# EAGLE design Access ID (EAGLE 8.3.0)
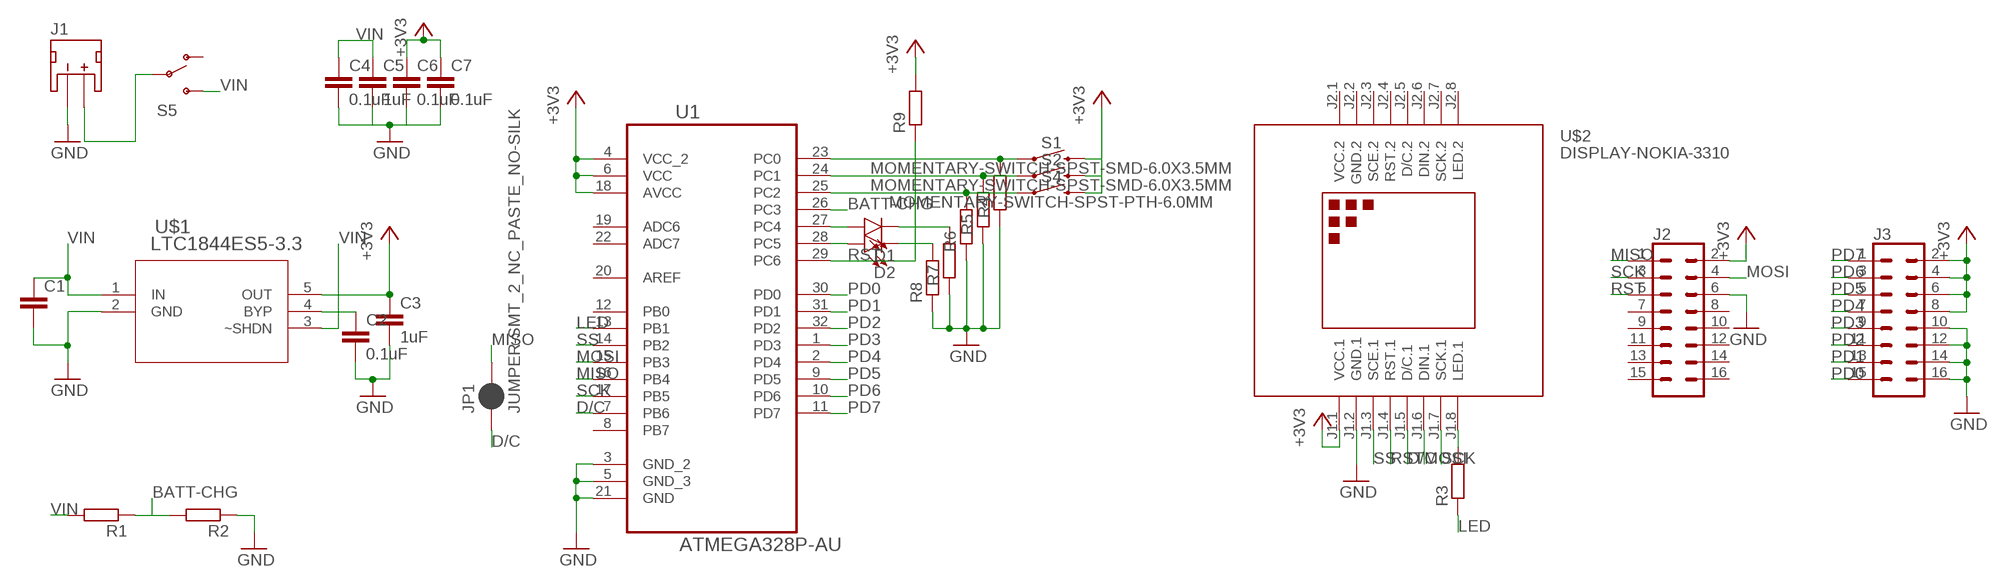
[diagram p0: schematic, sheet 1]

## Parts
C1  C-EUC0603K  [C0603K]
C2  0.1uF  C-EUC0603K  [C0603K]
C3  1uF  C-EUC0603K  [C0603K]
C4  0.1uF  C-EUC0603K  [C0603K]
C5  1uF  C-EUC0603K  [C0603K]
C6  0.1uF  C-EUC0603K  [C0603K]
C7  0.1uF  C-EUC0603K  [C0603K]
D1  LED0603  [LED-0603]
D2  LED0603  [LED-0603]
J1  JST_2MM_MALE  [JST-2-SMD]
J2  CONN_08X2  [2X8]
J3  CONN_08X2  [2X8]
JP1  JUMPER-SMT_2_NC_PASTE_NO-SILK  [SMT-JUMPER_2_NC_PASTE_NO-SILK]
R1  R-EU_R0603  [R0603]
R2  R-EU_R0603  [R0603]
R3  R-EU_R0603  [R0603]
R4  R-EU_R0603  [R0603]
R5  R-EU_R0603  [R0603]
R6  R-EU_R0603  [R0603]
R7  R-EU_R0603  [R0603]
R8  R-EU_R0603  [R0603]
R9  R-EU_R0603  [R0603]
S1  MOMENTARY-SWITCH-SPST-SMD-6.0X3.5MM  [TACTILE_SWITCH_SMD_6.0X3.5MM]
S2  MOMENTARY-SWITCH-SPST-SMD-6.0X3.5MM  [TACTILE_SWITCH_SMD_6.0X3.5MM]
S4  MOMENTARY-SWITCH-SPST-PTH-6.0MM  [TACTILE_SWITCH_PTH_6.0MM]
S5  SWITCH-SPDT-SMD-A  [SWITCH-SPST-SMD-A]
U1  ATMEGA328P-AU  [QFP80P900X900X120-32N]
U$1  LTC1844ES5-3.3  [TSOT-23_S5]
U$2  DISPLAY-NOKIA-3310  [DISPLAY-NOKIA-3310]

## Nets
+3V3: C3.1 C6.1 C7.1 J2.2 J3.2 J3.4 J3.6 J3.8 R9.2 S1.2 S2.2 S4.3 U1.4(VCC_2) U1.6(VCC) U1.18(AVCC) U$1.5(OUT) U$2.J1.1(VCC.1)
BATT-CHG: R1.1 R2.2 U1.26(PC3)
D/C: JP1.1 U1.7(PB6) U$2.J1.5(D/C.1)
GND: C1.2 C2.2 C3.2 C4.2 C5.2 C6.2 C7.2 J1.1(-) J2.6 J3.10 J3.12 J3.14 J3.16 R2.1 R4.1 R5.1 R6.1 R7.1 R8.1 U1.3(GND_2) U1.5(GND_3) U1.21(GND) U$1.2(GND) U$2.J1.2(GND.1)
LED: R3.1 U1.13(PB1)
MISO: J2.1 JP1.2 U1.16(PB4)
MOSI: J2.4 U1.15(PB3) U$2.J1.6(DIN.1)
N$2: C2.1 U$1.4(BYP)
N$5: R3.2 U$2.J1.8(LED.1)
N$7: J1.2(+) S5.2(P)
N$8: R5.2 S2.1 U1.24(PC1)
N$12: R6.2 S4.1 U1.25(PC2)
N$17: D2.C R8.2
N$18: R4.2 S1.1 U1.23(PC0)
N$19: D2.A U1.28(PC5)
N$20: D1.A U1.27(PC4)
N$21: D1.C R7.2
PD0: J3.15 U1.30(PD0)
PD1: J3.13 U1.31(PD1)
PD2: J3.11 U1.32(PD2)
PD3: J3.9 U1.1(PD3)
PD4: J3.7 U1.2(PD4)
PD5: J3.5 U1.9(PD5)
PD6: J3.3 U1.10(PD6)
PD7: J3.1 U1.11(PD7)
RST: J2.5 R9.1 U1.29(PC6) U$2.J1.4(RST.1)
SCK: J2.3 U1.17(PB5) U$2.J1.7(SCK.1)
SS: U1.14(PB2) U$2.J1.3(SCE.1)
VIN: C1.1 C4.1 C5.1 R1.2 S5.3(S) U$1.1(IN) U$1.3(~SHDN)
Unconnected: J1.NC1(PAD1) J1.NC2(PAD2) J2.7 J2.8 J2.9 J2.10 J2.11 J2.12 J2.13 J2.14 J2.15 J2.16 S5.1(O) U1.8(PB7) U1.12(PB0) U1.19(ADC6) U1.20(AREF) U1.22(ADC7) U$2.J2.3(SCE.2) U$2.J2.4(RST.2) U$2.J2.5(D/C.2) U$2.J2.6(DIN.2) U$2.J2.7(SCK.2) U$2.J2.8(LED.2)

## Power pins joined to a net without a drawn wire
GND.2: U$2.J2.2(GND.2)
VCC.2: U$2.J2.1(VCC.2)

## Library data of the parts
C1-C7 = resistor:C-EU: CAPACITOR, European symbol
D1 D2 = SparkFun-LED:LED: LED (Generic) Standard schematic elements and footprints for 5mm, 3mm, 1206, and 0603 sized LEDs. Generic LEDs with no color specified.
J1 = SparkFun-Connectors:JST_2MM_MALE: Mates to single-cell LiPo batteries. CONN-11443 Now with smashable polarity marks!; BTM_NEG: -; BTM_POS: +; PROD_ID: CONN-11443; TOP_NEG: -; TOP_POS: +
J2 J3 = SparkFun-Connectors:CONN_08X2: Multi connection point. Often used as Generic Header-pin footprint for 0.1 inch spaced/style header connections You can populate with any combo of single row headers, but if you'd like an exact match, check this: Header - 2x8 (Male, 0.1") <https://www.sparkfun.com/products/13156> (PRT-13156) On any of the 0.1 inch spaced packages, you can populate with these: Break Away Headers - Straight <https://www.sparkfun.com/products/116> (PRT-00116) Break Away Male Headers - Right Angle <https://www.sparkfun.com/products/553> (PRT-00553) Female Headers <https://www.sparkfun.com/products/115> (PRT-00115) Break Away Headers - Machine Pin <https://www.sparkfun.com/products/117> (PRT-00117) Break Away Female Headers - Swiss Machine Pin <https://www.sparkfun.com/products/743> (PRT-00743)
JP1 = SparkFun-Jumpers:JUMPER-SMT_2_NC_PASTE: Normally closed solder jumper This jumper has an aperture in the stencil to allow solder paste to bridge the split in the wire so it's normally closed (NC). Wick off the solder to open the connection. Reapply solder to reclose the connection.
R1-R9 = resistor:R-EU_: RESISTOR, European symbol
S1 S2 = SparkFun-Switches:MOMENTARY-SWITCH-SPST: Momentary Switch (Pushbutton) - SPST Normally-open (NO) SPST momentary switches (buttons, pushbuttons). Variants PTH-12MM - 12mm square, through-hole Momentary Pushbutton Switch - 12mm Square <https://www.sparkfun.com/products/9190> (COM-09190) PTH-6.0MM, PTH-6.0MM-KIT - 6.0mm square, through-hole Mini Pushbutton Switch <https://www.sparkfun.com/products/97> (COM-00097) KIT package intended for soldering kit's - only one side of pads' copper is exposed. PTH-RIGHT-ANGLE-KIT - Right-angle, through-hole Right Angle Tactile Button <https://www.sparkfun.com/products/10791> - Used on SparkFun BigTime Watch Kit <https://www.sparkfun.com/products/11734> SMD-12MM - 12mm square, surface-mount Tactile Button - SMD (12mm) <https://www.sparkfun.com/products/12993> (COM-12993) Used on SparkFun PicoBoard <https://www.sparkfun.com/products/11888> SMD-4.5MM - 4.5mm Square Trackball Switch Used on SparkFun Blackberry Trackballer Breakout <https://www.sparkfun.com/products/13169> SMD-4.6MMX2.8MM - 4.60mm x 2.80mm, surface mount Used on SparkFun SAMD21 Mini Breakout <https://www.sparkfun.com/products/13664> SMD-5.2MM, SMD-5.2-REDUNDANT - 5.2mm square, surface-mount Mini Pushbutton Switch - SMD <https://www.sparkfun.com/products/8720> (COM-08720) Used on Arduino Pro Mini <https://www.sparkfun.com/products/11114> REDUNDANT package connects both switch circuits together SMD-6.0X3.5MM - 6.0 x 3.5mm, surface mount Momentary Reset Switch SMD <https://www.sparkfun.com/products/8229> (COM-08229) SMD-6.2MM-TALL - 6.2mm square, surface mount Tactile Button - SMD (6mm) <https://www.sparkfun.com/products/12992> Used on SparkFun Digital Sandbox <https://www.sparkfun.com/products/12651> SMD-RIGHT-ANGLE - Right-angle, surface mount Used on SparkFun Block for Intel® Edison - Arduino <https://www.sparkfun.com/products/13036>; PROD_ID: SWCH-00815; SF_SKU: COM-08229
S4 = SparkFun-Switches:MOMENTARY-SWITCH-SPST: Momentary Switch (Pushbutton) - SPST Normally-open (NO) SPST momentary switches (buttons, pushbuttons). Variants PTH-12MM - 12mm square, through-hole Momentary Pushbutton Switch - 12mm Square <https://www.sparkfun.com/products/9190> (COM-09190) PTH-6.0MM, PTH-6.0MM-KIT - 6.0mm square, through-hole Mini Pushbutton Switch <https://www.sparkfun.com/products/97> (COM-00097) KIT package intended for soldering kit's - only one side of pads' copper is exposed. PTH-RIGHT-ANGLE-KIT - Right-angle, through-hole Right Angle Tactile Button <https://www.sparkfun.com/products/10791> - Used on SparkFun BigTime Watch Kit <https://www.sparkfun.com/products/11734> SMD-12MM - 12mm square, surface-mount Tactile Button - SMD (12mm) <https://www.sparkfun.com/products/12993> (COM-12993) Used on SparkFun PicoBoard <https://www.sparkfun.com/products/11888> SMD-4.5MM - 4.5mm Square Trackball Switch Used on SparkFun Blackberry Trackballer Breakout <https://www.sparkfun.com/products/13169> SMD-4.6MMX2.8MM - 4.60mm x 2.80mm, surface mount Used on SparkFun SAMD21 Mini Breakout <https://www.sparkfun.com/products/13664> SMD-5.2MM, SMD-5.2-REDUNDANT - 5.2mm square, surface-mount Mini Pushbutton Switch - SMD <https://www.sparkfun.com/products/8720> (COM-08720) Used on Arduino Pro Mini <https://www.sparkfun.com/products/11114> REDUNDANT package connects both switch circuits together SMD-6.0X3.5MM - 6.0 x 3.5mm, surface mount Momentary Reset Switch SMD <https://www.sparkfun.com/products/8229> (COM-08229) SMD-6.2MM-TALL - 6.2mm square, surface mount Tactile Button - SMD (6mm) <https://www.sparkfun.com/products/12992> Used on SparkFun Digital Sandbox <https://www.sparkfun.com/products/12651> SMD-RIGHT-ANGLE - Right-angle, surface mount Used on SparkFun Block for Intel® Edison - Arduino <https://www.sparkfun.com/products/13036>; PROD_ID: SWCH-08441; SF_SKU: COM-00097
S5 = SparkFun-Electromechanical:SWITCH-SPDT: SPDT Switch Simple slide switch, Spark Fun Electronics SKU : COM-00102 DPDT SMT slide switch, AYZ0202, SWCH-08179; PROD_ID: SWCH-10651
U1 = Atmel_By_element14_Batch_1-00:ATMEGA328P-AU: 8-bit Microcontroller with In-System Programmable Flash; MPN: ATMEGA328P-AU; OC_FARNELL: 1715486; OC_NEWARK: 14R4631; PACKAGE: TQFP-32; SUPPLIER: Atmel
U$1 = Beeclust:LTC1844ES5-3.3
U$2 = diy-modules:DISPLAY-NOKIA-3310: 84x48 Dot Matrix LCD Module based on Nokia 3310 display More details available here: https://arduinoandsoftware.wordpress.com/2012/12/30/nokia-33105110-3-3v-display-with-5v-arduino/

## Board
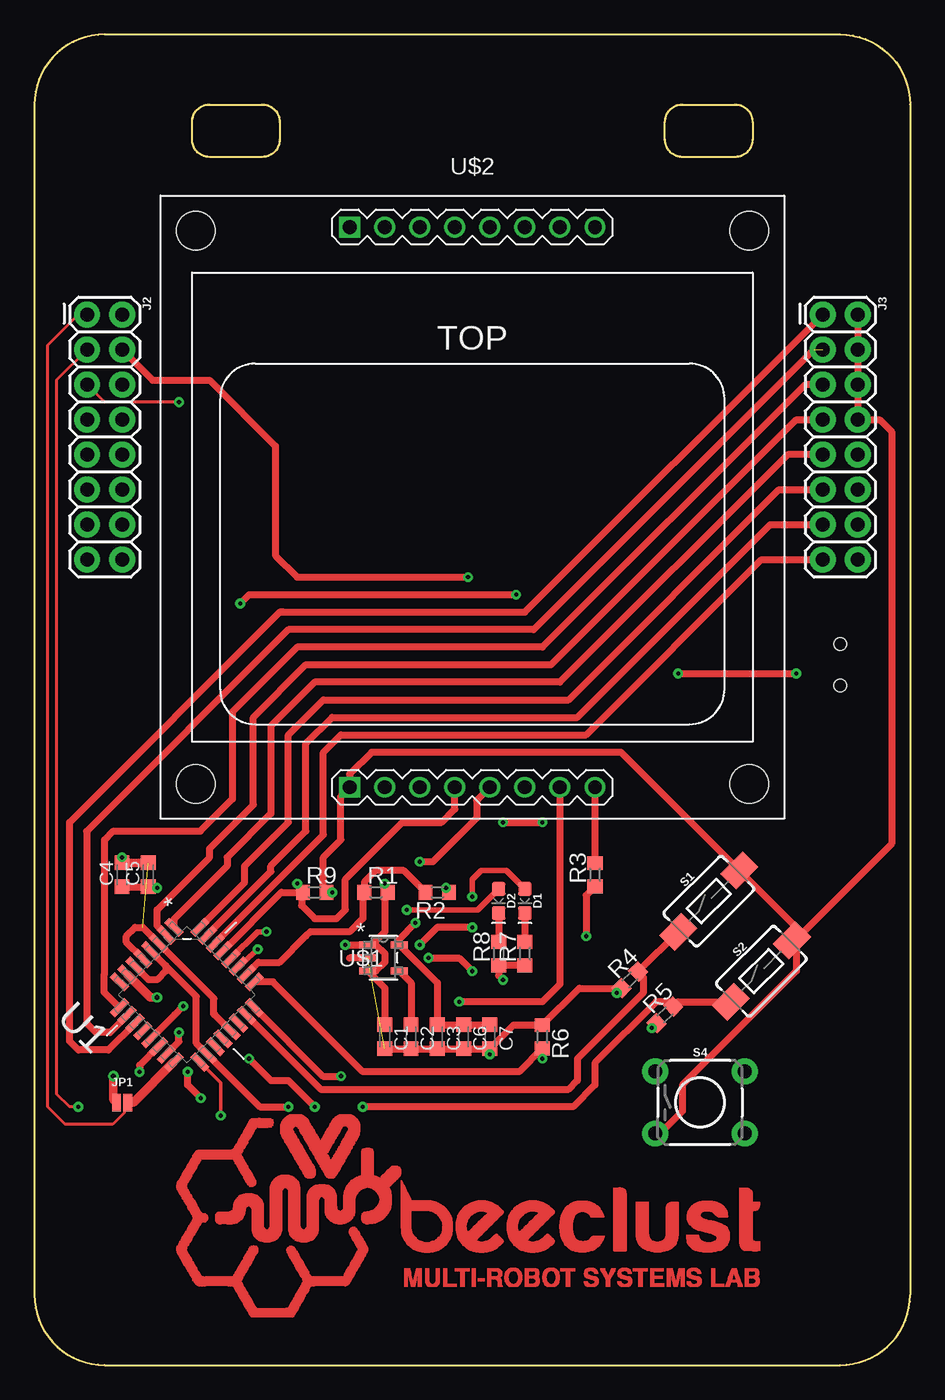
[diagram p1: board, top side]
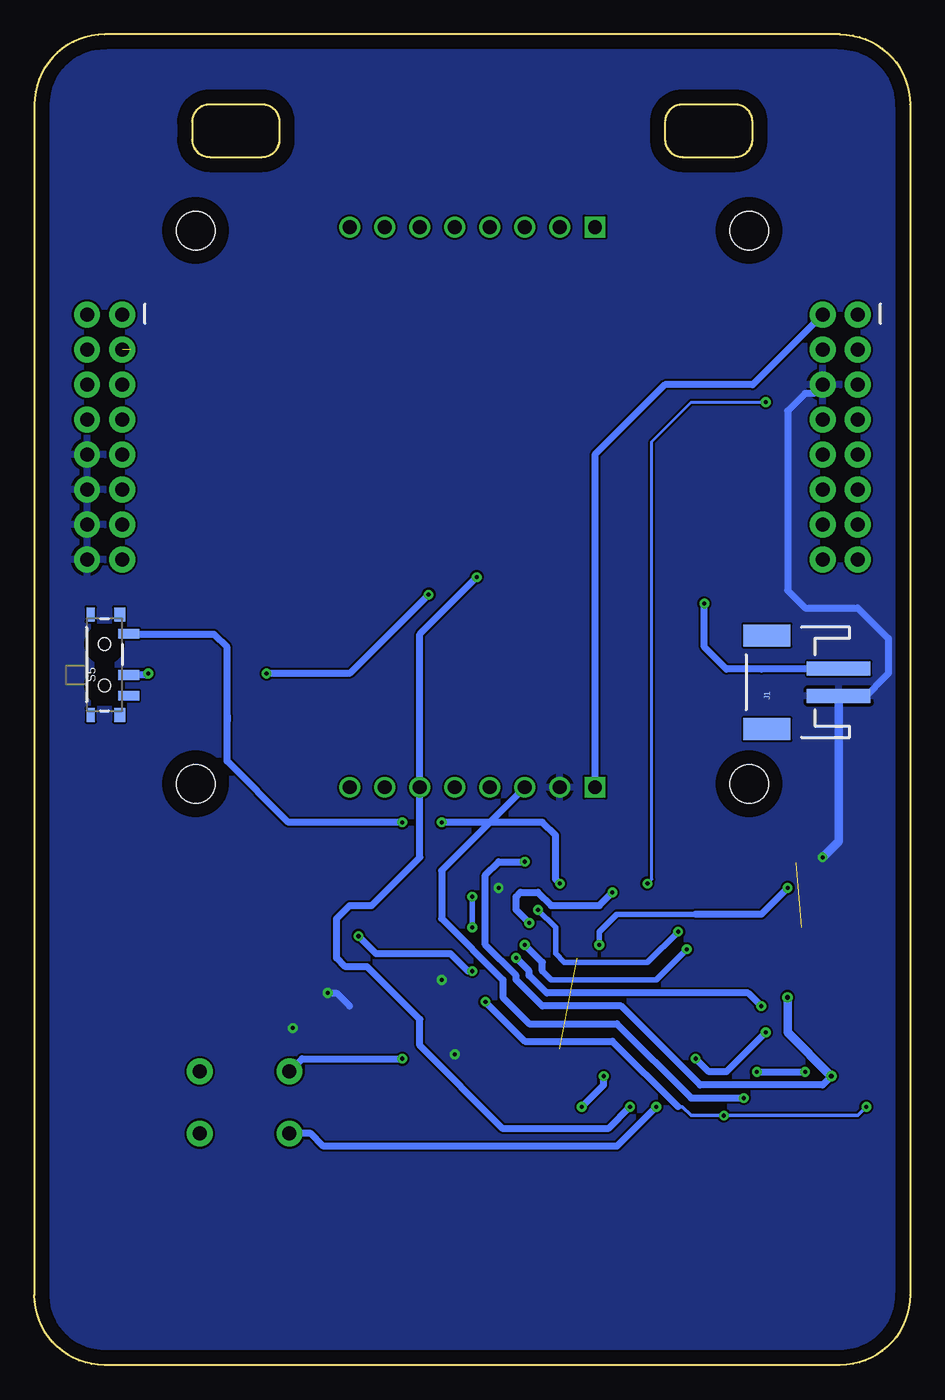
[diagram p2: board, bottom side, seen from below]

Size 63.5 x 96.52 mm. Coordinates in mm from the lower left corner, seen from the top.
Outline: 5.08,96.52 58.42,96.52 arc-90 63.5,91.44 63.5,5.08 arc-90 58.42,0 5.08,0 arc-90 0,5.08 0,91.44 arc-90 5.08,96.52
Outline: 11.43,90.17 arc-90 12.7,91.44 16.51,91.44 arc-90 17.78,90.17 17.78,88.9 arc-90 16.51,87.63 12.7,87.63 arc-90 11.43,88.9 11.43,90.17
Outline: 45.72,90.17 arc-90 46.99,91.44 50.8,91.44 arc-90 52.07,90.17 52.07,88.9 arc-90 50.8,87.63 46.99,87.63 arc-90 45.72,88.9 45.72,90.17
Copper layers (1*16): Top 0.035mm / dielectric 1.5mm / Bottom 0.035mm
Design rules "default": minimum track width 6mil, minimum drill 0.35mm, track to track 6mil, track to pad 6mil, pad to pad 6mil, via to via 6mil, smd to smd 6mil, copper to edge 40mil, drill to drill 6mil, minimum pad ring 10mil, minimum via ring 8mil, stop-mask expansion 4mil, vias tented up to drill 0mil, thermal gap 10mil

### Footprints (pad centres in the part's own frame; a part is rotated, then mirrored left to right if it is on the bottom)
C0603K = smd 1.05 x 1.08: 1 -0.875,0; 2 0.875,0
LED-0603 = smd 1 x 1: A -0.877,0; C 0.877,0
JST-2-SMD = smd 1 x 4.6: 1 -1,-3.7; 2 1,-3.7 | smd 1.6 x 3.4: NC1 -3.4,1.5; NC2 3.4,1.5
2X8 = drill 1.016 pad 1.88: 1 0,0; 2 0,2.54; 3 2.54,0; 4 2.54,2.54; 5 5.08,0; 6 5.08,2.54; 7 7.62,0; 8 7.62,2.54; 9 10.16,0; 10 10.16,2.54; 11 12.7,0; 12 12.7,2.54; 13 15.24,0; 14 15.24,2.54; 15 17.78,0; 16 17.78,2.54
SMT-JUMPER_2_NC_PASTE_NO-SILK = smd 0.635 x 1.27: 1 -0.406,0; 2 0.406,0
R0603 = smd 1 x 1.1: 1 -0.85,0; 2 0.85,0
TACTILE_SWITCH_SMD_6.0X3.5MM = smd 2.3 x 1.6: 1 -3.15,0; 2 3.15,0
TACTILE_SWITCH_PTH_6.0MM = drill 1.016 pad 1.88: 1 -3.251,2.261; 2 3.251,2.261; 3 -3.251,-2.261; 4 3.251,-2.261
SWITCH-SPST-SMD-A = smd 0.7 x 1.5: 1 -2.25,-1.75; 2 -0.75,-1.75; 3 2.25,-1.75 | smd 1 x 0.6: GND1 -3.65,1; GND3 3.65,1 | smd 1 x 0.8: GND2 -3.65,-1.1; GND4 3.65,-1.1 | hole 0.9: -1.5,0; 1.5,0
QFP80P900X900X120-32N = smd 1.473 x 0.508: 1 -4.115,2.794; 2 -4.115,2.007; 3 -4.115,1.194; 4 -4.115,0.406; 5 -4.115,-0.406; 6 -4.115,-1.194; 7 -4.115,-2.007; 8 -4.115,-2.794; 17 4.115,-2.794; 18 4.115,-2.007; 19 4.115,-1.194; 20 4.115,-0.406; 21 4.115,0.406; 22 4.115,1.194; 23 4.115,2.007; 24 4.115,2.794 | smd 0.508 x 1.473: 9 -2.794,-4.115; 10 -2.007,-4.115; 11 -1.194,-4.115; 12 -0.406,-4.115; 13 0.406,-4.115; 14 1.194,-4.115; 15 2.007,-4.115; 16 2.794,-4.115; 25 2.794,4.115; 26 2.007,4.115; 27 1.194,4.115; 28 0.406,4.115; 29 -0.406,4.115; 30 -1.194,4.115; 31 -2.007,4.115; 32 -2.794,4.115
TSOT-23_S5 = smd 1.219 x 0.508: 1 -1.143,0.95; 2 -1.143,0; 3 -1.143,-0.95; 4 1.143,-0.95; 5 1.143,0.95
DISPLAY-NOKIA-3310 = drill 1 square: J1.1 -8.89,-20.32; J2.1 -8.89,20.32 | drill 1: J1.2 -6.35,-20.32; J1.3 -3.81,-20.32; J1.4 -1.27,-20.32; J1.5 1.27,-20.32; J1.6 3.81,-20.32; J1.7 6.35,-20.32; J1.8 8.89,-20.32; J2.2 -6.35,20.32; J2.3 -3.81,20.32; J2.4 -1.27,20.32; J2.5 1.27,20.32; J2.6 3.81,20.32; J2.7 6.35,20.32; J2.8 8.89,20.32 | hole 2.8: -20.066,-20.066; 20.066,-20.066; 20.066,20.066; -20.066,20.066

### Placement (x,y rotation side)
C1  25.4,23.81 270 top
C2  27.3,23.81 270 top
C3  29.21,23.81 270 top
C4  6.35,35.56 90 top
C5  8.26,35.56 90 top
C6  31.11,23.81 270 top
C7  33.02,23.81 270 top
D1  35.56,33.66 270 top
D2  33.66,33.66 270 top
J1  8.89,49.53 90 bottom
J2  3.81,76.2 270 top
J3  57.15,76.2 270 top
JP1  6.35,19.05 0 top
R1  24.77,34.29 0 top
R2  29.21,34.29 180 top
R3  40.64,35.56 90 top
R4  43.18,27.94 45 top
R5  45.72,25.4 45 top
R6  36.83,23.81 270 top
R7  35.56,29.84 90 top
R8  33.66,29.84 90 top
R9  20.32,34.29 0 top
S1  48.9,33.66 45 top
S2  52.7,28.57 45 top
S4  48.26,19.05 0 top
S5  58.42,50.8 90 bottom
U1  11.05,26.86 315 top
U$1  25.3,29.54 0 top
U$2  31.75,62.23 0 top

### Tracks (layer width: path | path; a pad name or v marks a point on that pad's centre or on a via)
+3V3  (via drill 0.3)
  Top 0.508: U1.6 8.28,27.94 8.89,27.94 9.53,28.57 9.53,28.96 | U1.4 9.53,28.96 | 54.93,30.58 54.93,30.48 55.24,30.16 55.24,31.76 S1.2 42.55,44.45 24.45,44.45 22.86,42.86 U$2.J1.1 22.23,41.27 22.23,38.1 20.95,36.83 20.95,34.51 R9.2 v21.59,34.29 | 54.93,30.58 S2.2 55.24,30.49 55.24,28.57 46.99,20.32 46.99,18.41 45.36,16.79 S4.3 | C7.1 C6.1 C3.1 29.21,27.72 U$1.5 26.44,30.89 v27.62,32.07 | J3.2 J3.4 J3.6 J3.8 61.28,68.58 62.15,67.7 62.15,37.8 54.93,30.58 | 9.53,28.96 11.75,26.74 11.75,23.32 U1.18 16.34,18.73 v18.41,18.73
  Bottom 0.508: J2.2 11.43,71.12 17.78,71.12 22.86,66.04 U$2.J1.1 | v27.62,32.07 28.57,33.02 28.57,33.97 28.26,34.29 26.99,34.29 26.04,33.34 22.54,33.34 v21.59,34.29 | v18.41,18.73 21.27,15.88 42.55,15.88 43.46,16.79 S4.3
BATT-CHG
  Top 0.508: R2.2 26.77,35.88 24.77,35.88 23.91,35.03 R1.1 23.81,34.19 23.81,32.38 22.86,31.43 20,31.43 19.68,31.12 17.78,29.21 16.24,29.21 U1.26
D/C  (via drill 0.3, 0.35)
  Top 0.508: U$2.J1.5 32.07,40.96 32.07,39.69 28.89,36.51 v27.94,36.51
  Top 0.61: U1.7 8.4,26.67 v8.89,26.67 | JP1.1 5.71,19.28 v5.71,20.96
  Bottom 0.508: v5.71,20.96 6.35,20.32 15.24,20.32 20.95,26.04 26.67,26.04 28.57,27.94 28.57,28.26 30.8,30.48 30.8,35.56 29.84,36.51 v27.94,36.51
  Bottom 0.61: v8.89,26.67 8.89,24.13 v5.71,20.96
GND  (via drill 0.3)  (2 unrouted)
  Top 0.508: U$1.2 24.14,29.53 22.86,29.53 | C1.2 C2.2 C3.2 C6.2 C7.2 | C7.2 34.74,24.66 R6.1 39.51,27.34 R4.1 v42.23,26.99 | R7.1 R8.1 33.66,28.26 v33.97,27.94 | U1.21 13.08,25.4 13.02,25.4 13.02,26.58 U1.3 7.85,31.75 7.3,31.75 6.67,31.12 6.67,30.67 U1.5 | R5.1 v44.77,24.45 | R2.1 30.06,34.39 v29.84,34.61 | C7.2 v33.02,22.54
  Top 0.61: v6.35,36.83 C4.2 C5.2
  Bottom 0.508: J2.6 6.99,70.48 7.62,70.48 8.89,69.21 8.89,56.2 7.62,54.93 3.81,54.93 1.59,52.7 1.59,50.16 3.49,48.26 4.13,48.26 4.24,48.38 5.19,48.38 | v42.23,26.99 41.59,26.99 40.64,26.04
  Bottom 0.61: v6.35,36.83 5.19,37.99 5.19,48.38 J1.1
  pour Bottom: 0,88.58 0,91.44 arc-90 5.08,96.52 58.42,96.52 arc-90 63.5,91.44 63.5,5.4 arc-90 58.1,0 4.76,0 arc-90 0,4.76
LED  (via drill 0.3)
  Top 0.508: U1.13 10.16,25.4 v10.79,26.04 | R3.1 40.01,34.08 v40.01,31.12 | v28.57,29.53 30.8,29.53 v31.75,28.57
  Bottom 0.508: v10.79,26.04 11.75,26.99 26.35,26.99 27.62,28.26 27.62,28.57 v28.57,29.53 | v40.01,31.12 38.73,29.84 33.34,29.84 32.07,28.57 v31.75,28.57
MISO
  Top 0.203: JP1.2 6.51,18.81 6.51,18.31 5.67,17.46 2.22,17.46 0.95,18.73 0.95,73.98 3.17,76.2 J2.1
  Top 0.61: U1.16 7.19,19.05 JP1.2
MOSI  (via drill 0.3)
  Top 0.508: J2.4 8.57,71.44 12.7,71.44 17.46,66.67 17.46,58.74 19.05,57.15 v31.43,57.15 | U1.15 10.48,23.45 v10.48,24.13 | v15.56,22.23 17.14,20.64 18.41,20.64 v20.32,18.73
  Bottom 0.508: v31.43,57.15 35.56,53.02 U$2.J1.6 35.56,36.83 39.05,33.34 40.64,33.34 41.59,32.38 41.59,29.53 40.96,28.89 39.37,28.89 35.56,25.08 35.56,23.18 29.53,17.14 21.91,17.14 v20.32,18.73 | v15.56,22.23 14.61,21.27 13.34,21.27 v10.48,24.13
N$2
  Top 0.508: U$1.4 27.3,27.73 C2.1
N$5
  Top 0.508: U$2.J1.8 R3.2
N$7  (via drill 0.3)
  Top 0.508: v14.92,55.24 15.56,55.88 v34.92,55.88 | v46.67,50.16 v55.24,50.16
  Bottom 0.508: J1.2 5.24,50.48 10.79,50.48 13.34,50.48 14.92,52.07 v14.92,55.24 | v34.92,55.88 40.64,50.16 v46.67,50.16 | v55.24,50.16 55.36,50.05 S5.2
N$8  (via drill 0.3)
  Top 0.508: U1.24 20.91,20.96 v22.23,20.96 | v23.81,18.73 39.05,18.73 40.64,20.32 40.64,21.91 45.09,26.35 45.97,26.35 R5.2 46.67,26.35 S2.1
  Bottom 0.508: v23.81,18.73 22.23,20.32 v22.23,20.96
N$12  (via drill 0.3)
  Top 0.508: U1.25 17.29,27.79 23.81,21.27 35.14,21.27 R6.2 v36.83,22.23
  Bottom 0.508: 44.97,21.27 S4.1 44.09,22.23 v36.83,22.23
N$17
  Top 0.508: D2.C R8.2
N$18
  Top 0.508: S1.1 R4.2 44.13,28.19 44.13,26.99 39.37,22.23 39.37,20.64 38.73,20 20.75,20 U1.23
N$19  (via drill 0.3)
  Top 0.406: D2.A 32.14,33.02 v26.99,33.02 | U1.28 16.2,31.43 v16.83,31.43
  Bottom 0.406: v26.99,33.02 25.72,31.75 25.72,29.84 25.08,29.21 19.05,29.21 v16.83,31.43
N$20  (via drill 0.3)
  Top 0.406: D1.A 34.22,35.88 32.38,35.88 31.75,35.24 v31.75,33.97 | U1.27 v16.19,30.16
  Top 0.508: v31.75,31.75 29.21,31.75 v27.94,30.48
  Bottom 0.406: 26.67,28.57 26.04,27.94 18.41,27.94 v16.19,30.16 | v31.75,31.75 v31.75,33.97
  Bottom 0.508: 26.67,28.57 26.67,29.21 v27.94,30.48
N$21
  Top 0.508: D1.C R7.2
PD0
  Top 0.508: U1.30 20.95,38.45 20.95,44.45 22.23,45.72 40.01,45.72 52.7,58.42 J3.15
PD1
  Top 0.508: U1.31 17.14,35.79 17.14,36.2 19.68,38.73 19.68,45.09 21.59,46.99 39.37,46.99 53.34,60.96 J3.13
PD2
  Top 0.508: U1.32 15.24,35 15.24,36.2 18.41,39.37 18.41,45.72 20.95,48.26 38.73,48.26 53.98,63.5 J3.11
PD3
  Top 0.508: J3.9 54.61,66.04 38.1,49.53 20.32,49.53 17.14,46.36 17.14,40.01 13.97,36.83 13.97,36.2 10.12,32.34 U1.1
PD4
  Top 0.508: U1.2 8.89,31.86 8.89,33.02 12.7,36.83 12.7,37.47 15.88,40.64 15.88,46.99 19.68,50.8 37.47,50.8 55.24,68.58 J3.7
PD5
  Top 0.508: 55.17,70.41 55.24,70.48 | 55.17,70.41 36.83,52.07 19.05,52.07 14.35,47.37 14.35,41.06 12.03,38.73 5.71,38.73 5.08,38.1 5.08,28.33 5.06,28.3 5.06,27.03 U1.9 | J3.5 55.88,71.12 55.17,70.41
PD6  (1 unrouted)
  Top 0.508: 56.52,73.66 36.2,53.34 18.41,53.34 3.79,38.71 3.79,24.79 4.45,24.13 5.48,24.13 U1.10
PD7
  Top 0.508: J3.1 35.56,54.61 18.09,54.61 | 18.09,54.61 17.78,54.61 | U1.11 5.36,22.86 3.17,22.86 2.54,23.5 2.54,39.37 17.78,54.61 | 17.78,54.61 18.09,54.61
RST  (via drill 0.3)
  Top 0.203: J2.5 5.08,69.85 v10.48,69.85 | R9.1 19.05,34.71 v19.05,34.93
  Top 0.508: U1.29 17.9,34.29 R9.1 19.37,34.19 19.37,33.34 20.32,32.38 21.91,32.38 22.54,33.02 22.54,35.24 26.67,39.37 29.53,39.37 30.48,40.32 U$2.J1.4
  Bottom 0.203: v19.05,34.93 18.73,35.24 18.73,66.99 15.88,69.85 v10.48,69.85
SCK  (via drill 0.3)
  Top 0.203: v3.17,18.73 2.54,18.73 1.59,19.69 1.59,71.44 J2.3
  Top 0.254: U1.17 13.51,20.45 v13.51,18.1
  Top 0.508: U$2.J1.7 38.1,27.62 36.83,26.35 v30.8,26.35
  Bottom 0.254: v3.17,18.73 3.81,18.1 v13.51,18.1 15.88,18.1 16.51,18.73 16.83,18.73
  Bottom 0.508: v30.8,26.35 27.94,23.5 21.59,23.5 16.83,18.73
SS  (via drill 0.3)
  Top 0.508: v12.06,19.37 11.11,20.32 v11.11,21.27 | U1.14 7.62,21.74 v7.62,21.27
  Bottom 0.508: U$2.J1.3 33.97,35.88 33.97,32.38 29.53,27.94 29.53,26.67 27.62,24.77 21.27,24.77 15.88,19.37 v12.06,19.37 | v11.11,21.27 v7.62,21.27
VIN  (via drill 0.3)
  Top 0.508: C4.1 C5.1 8.33,34.61 v8.89,34.61 | U$1.1 24.46,30.49 25.4,31.43 25.4,34.08 R1.2 25.4,34.51 v25.4,34.93 | v22.54,30.48 22.55,30.49 U$1.1 | U$1.1 24.75,30.49 25.4,29.84 25.4,29.21 24.77,28.57 24.17,28.57 U$1.3 25.4,27.35 C1.1 | v33.97,39.37 v36.83,39.37
  Bottom 0.406: 15.56,32.7 21.27,32.7 22.54,31.43 v22.54,30.48
  Bottom 0.508: v8.89,34.61 10.79,32.7 15.56,32.7 | S5.3 56.64,53.02 50.48,53.02 49.53,52.07 49.53,47.16 | 49.53,47.16 49.53,46.67 | v25.4,34.93 25.72,35.24 25.72,38.42 26.67,39.37 v33.97,39.37 | v36.83,39.37 45.09,39.37 49.53,43.81 49.53,47.16
(copper drawn outside any net)
  shapes: Top area x4580